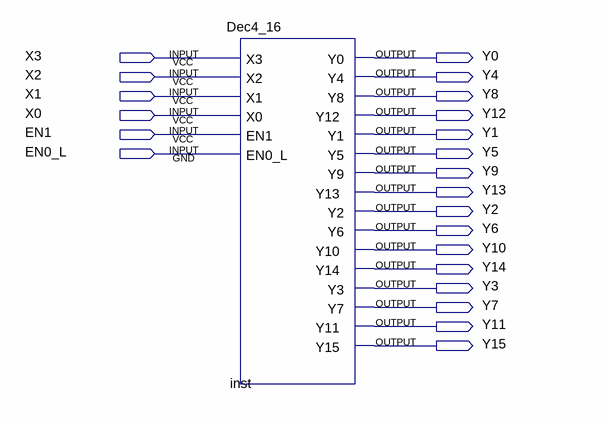
[diagram p0: schematic sheet]
// Quartus schematic DecoderDemo2.bdf as structural Verilog: 1 symbols, 22 pins
module DecoderDemo2 (
  input  X3,
  input  X2,
  input  X1,
  input  X0,
  input  EN1,
  input  EN0_L,
  output Y0,
  output Y4,
  output Y8,
  output Y12,
  output Y1,
  output Y5,
  output Y9,
  output Y13,
  output Y2,
  output Y6,
  output Y10,
  output Y14,
  output Y3,
  output Y7,
  output Y11,
  output Y15
);

  Dec4_16 inst (
    .X3(X3), .X2(X2), .X1(X1), .X0(X0), .EN1(EN1), .EN0_L(EN0_L), .Y0(Y0), .Y4(Y4), .Y8(Y8), .Y12(Y12),
    .Y1(Y1), .Y5(Y5), .Y9(Y9), .Y13(Y13), .Y2(Y2), .Y6(Y6), .Y10(Y10), .Y14(Y14), .Y3(Y3), .Y7(Y7),
    .Y11(Y11), .Y15(Y15));
endmodule
